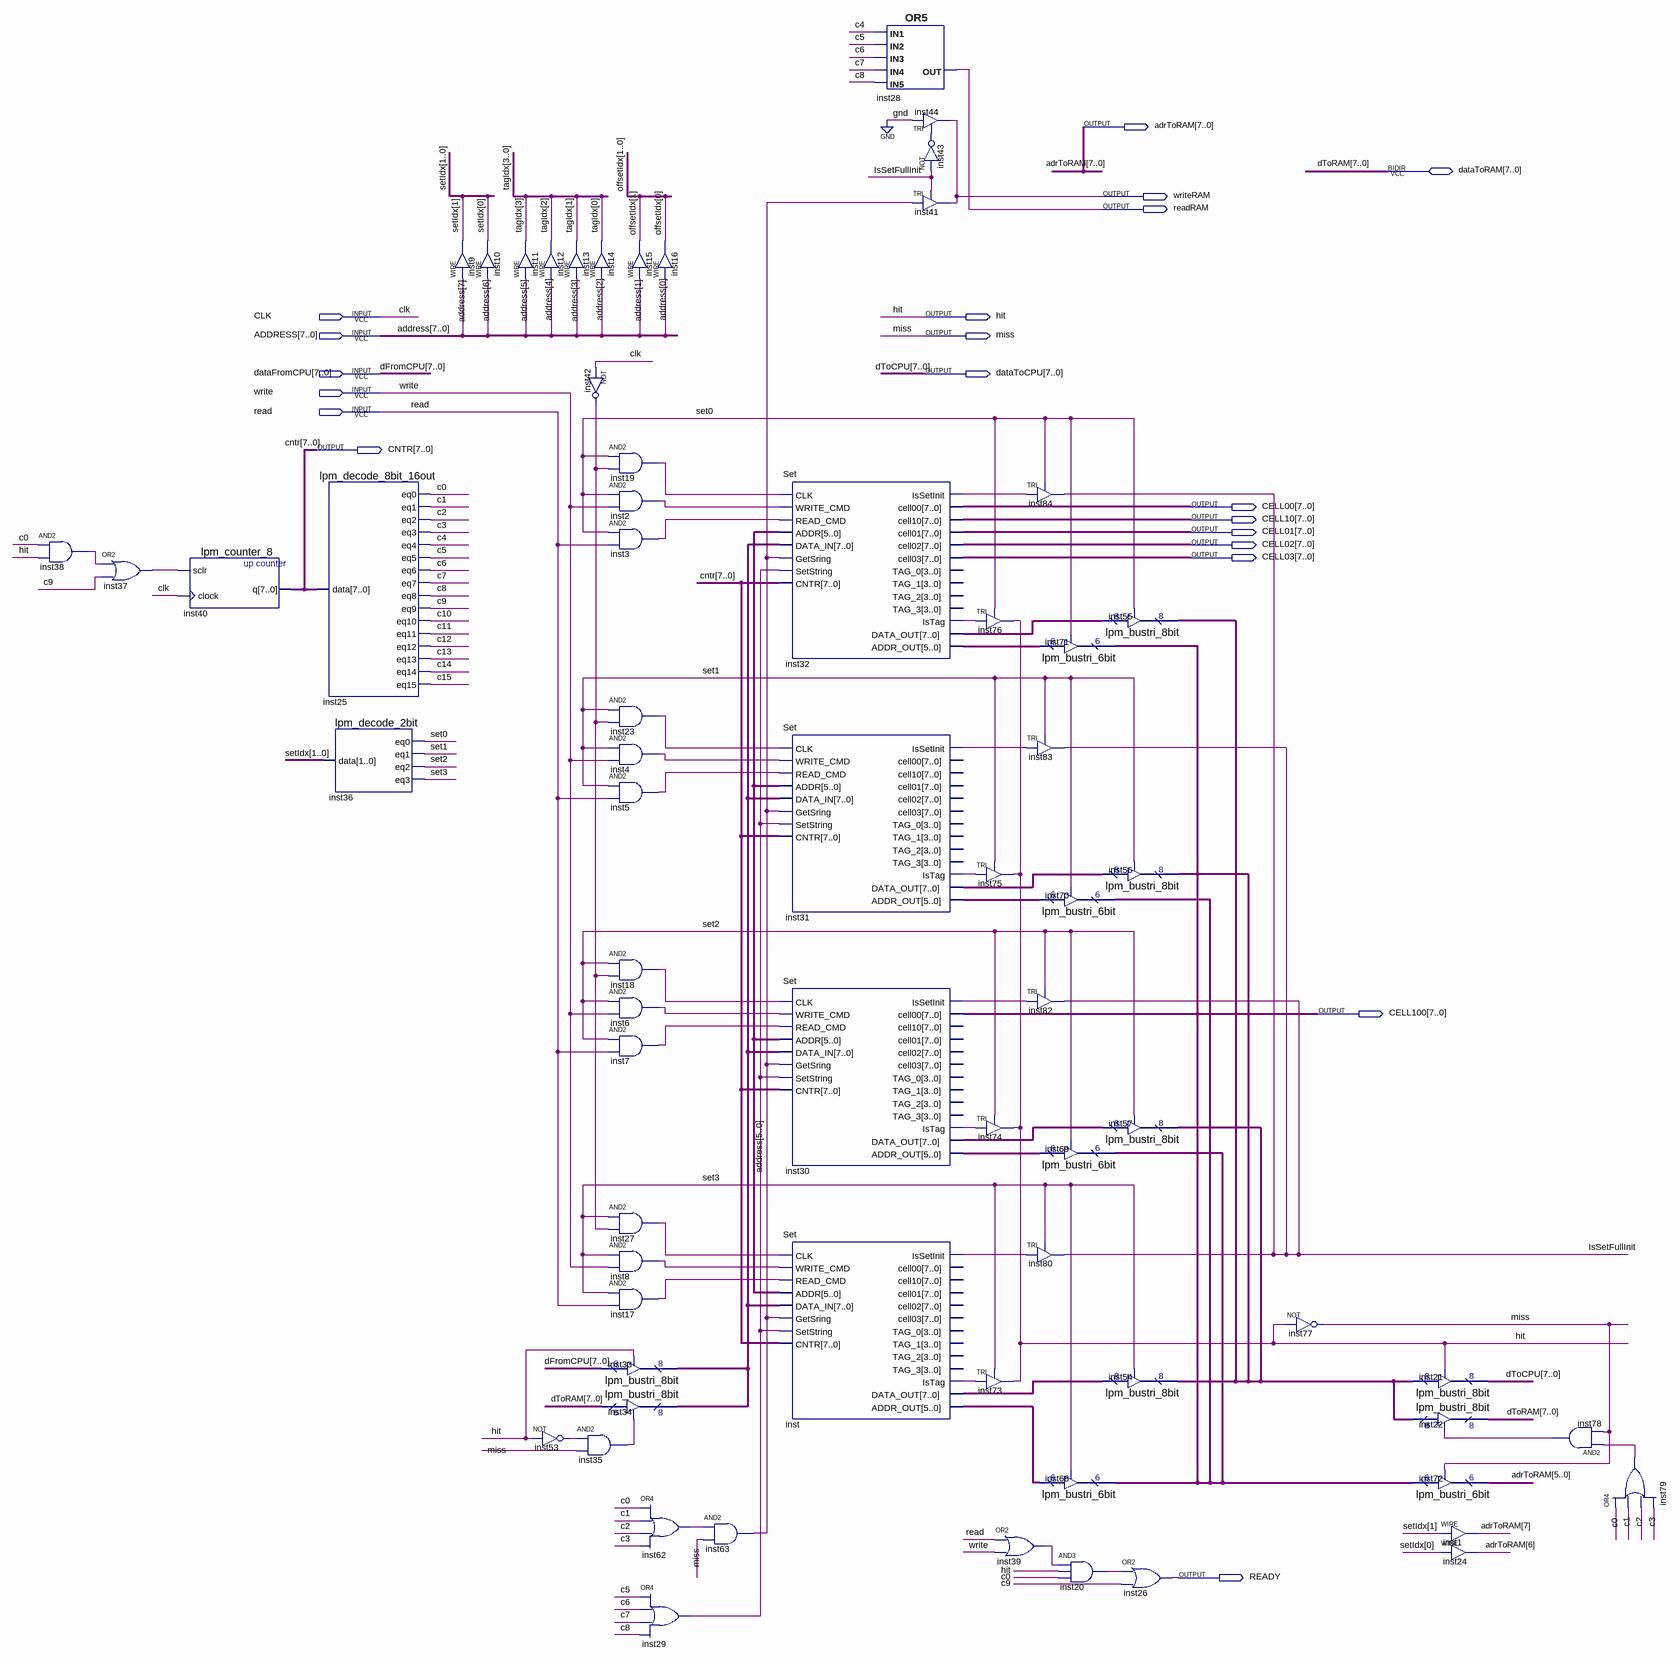
[diagram p0: schematic sheet]
// Quartus schematic Cache.bdf as structural Verilog: 68 symbols, 20 pins
module Cache (
  input  CLK,
  input  [7:0] ADDRESS,
  input  [7:0] dataFromCPU,
  input  write,
  input  read,
  inout  [7:0] dataToRAM,
  output [7:0] adrToRAM,
  output writeRAM,
  output readRAM,
  output hit,
  output miss,
  output [7:0] dataToCPU,
  output [7:0] CNTR,
  output [7:0] CELL00,
  output [7:0] CELL10,
  output [7:0] CELL01,
  output [7:0] CELL02,
  output [7:0] CELL03,
  output [7:0] CELL100,
  output READY
);

  wire c0, c1, c2, c3, c4, c5, c6, c7, c8, c9, c10, c11, c12, c13, c14, c15, inst2_out, inst3_out, inst4_out,
       inst5_out, inst6_out, inst7_out, inst8_out, inst17_out, inst18_out, inst19_out, inst20_out,
       inst23_out, inst27_out, inst29_out, inst30_issetinit, inst30_istag, inst31_issetinit, inst31_istag,
       inst32_issetinit, inst32_istag, inst35_out, inst37_out, inst38_out, inst39_out, inst42_out,
       inst43_out, inst53_out, inst62_out, inst63_out, inst78_out, inst79_out, inst_issetinit, inst_istag,
       IsSetFullInit, set0, set1, set2, set3;
  wire [1:0] offsetIdx, setIdx;
  wire [3:0] tagIdx;
  wire [5:0] inst30_addr_out, inst31_addr_out, inst32_addr_out, inst71_tridata, inst_addr_out;
  wire [7:0] inst30_data_out, inst31_data_out, inst32_data_out, inst33_tridata, inst55_tridata, inst_data_out;

  and inst38 (inst38_out, c0, hit);
  or inst37 (inst37_out, inst38_out, c9);
  lpm_counter_8 inst40 (.sclr(inst37_out), .clock(CLK), .q(CNTR));
  lpm_decode_8bit_16out inst25 (
    .data(CNTR), .eq0(c0), .eq1(c1), .eq2(c2), .eq3(c3), .eq4(c4), .eq5(c5), .eq6(c6), .eq7(c7), .eq8(c8),
    .eq9(c9), .eq10(c10), .eq11(c11), .eq12(c12), .eq13(c13), .eq14(c14), .eq15(c15));
  lpm_decode_2bit inst36 (.data(setIdx), .eq0(set0), .eq1(set1), .eq2(set2), .eq3(set3));
  assign setIdx[1] = ADDRESS[7];  // WIRE inst9
  assign setIdx[0] = ADDRESS[6];  // WIRE inst10
  assign tagIdx[3] = ADDRESS[5];  // WIRE inst11
  assign tagIdx[2] = ADDRESS[4];  // WIRE inst12
  assign tagIdx[1] = ADDRESS[3];  // WIRE inst13
  and inst35 (inst35_out, inst53_out, miss);
  not inst53 (inst53_out, hit);
  assign tagIdx[0] = ADDRESS[2];  // WIRE inst14
  assign offsetIdx[1] = ADDRESS[1];  // WIRE inst15
  not inst42 (inst42_out, CLK);
  and inst19 (inst19_out, set0, inst42_out);
  and inst2 (inst2_out, set0, write);
  and inst3 (inst3_out, set0, read);
  and inst23 (inst23_out, set1, inst42_out);
  and inst4 (inst4_out, set1, write);
  and inst5 (inst5_out, set1, read);
  and inst18 (inst18_out, set2, inst42_out);
  and inst6 (inst6_out, set2, write);
  and inst7 (inst7_out, set2, read);
  and inst27 (inst27_out, set3, inst42_out);
  and inst8 (inst8_out, set3, write);
  and inst17 (inst17_out, set3, read);
  lpm_bustri_8bit inst33 (.enabledt(hit), .data(dataFromCPU), .tridata(inst33_tridata));
  lpm_bustri_8bit inst34 (.enabledt(inst35_out), .data(dataToRAM), .tridata(inst33_tridata));
  assign offsetIdx[0] = ADDRESS[0];  // WIRE inst16
  or inst62 (inst62_out, c0, c1, c2, c3);
  or inst29 (inst29_out, c5, c6, c7, c8);
  and inst63 (inst63_out, inst62_out, miss);
  Set inst32 (
    .CLK(inst19_out), .WRITE_CMD(inst2_out), .READ_CMD(inst3_out), .ADDR(ADDRESS[5:0]),
    .DATA_IN(inst33_tridata), .GetSring(inst63_out), .SetString(inst29_out), .CNTR(CNTR),
    .IsSetInit(inst32_issetinit), .cell00(CELL00), .cell10(CELL10), .cell01(CELL01), .cell02(CELL02),
    .cell03(CELL03), .IsTag(inst32_istag), .DATA_OUT(inst32_data_out), .ADDR_OUT(inst32_addr_out));  // open: TAG_0, TAG_1, TAG_2, TAG_3
  Set inst31 (
    .CLK(inst23_out), .WRITE_CMD(inst4_out), .READ_CMD(inst5_out), .ADDR(ADDRESS[5:0]),
    .DATA_IN(inst33_tridata), .GetSring(inst63_out), .SetString(inst29_out), .CNTR(CNTR),
    .IsSetInit(inst31_issetinit), .IsTag(inst31_istag), .DATA_OUT(inst31_data_out), .ADDR_OUT(inst31_addr_out));  // open: cell00, cell10, cell01, cell02, cell03, TAG_0, TAG_1, TAG_2, TAG_3
  Set inst30 (
    .CLK(inst18_out), .WRITE_CMD(inst6_out), .READ_CMD(inst7_out), .ADDR(ADDRESS[5:0]),
    .DATA_IN(inst33_tridata), .GetSring(inst63_out), .SetString(inst29_out), .CNTR(CNTR),
    .IsSetInit(inst30_issetinit), .cell00(CELL100), .IsTag(inst30_istag), .DATA_OUT(inst30_data_out),
    .ADDR_OUT(inst30_addr_out));  // open: cell10, cell01, cell02, cell03, TAG_0, TAG_1, TAG_2, TAG_3
  Set inst (
    .CLK(inst27_out), .WRITE_CMD(inst8_out), .READ_CMD(inst17_out), .ADDR(ADDRESS[5:0]),
    .DATA_IN(inst33_tridata), .GetSring(inst63_out), .SetString(inst29_out), .CNTR(CNTR),
    .IsSetInit(inst_issetinit), .IsTag(inst_istag), .DATA_OUT(inst_data_out), .ADDR_OUT(inst_addr_out));  // open: cell00, cell10, cell01, cell02, cell03, TAG_0, TAG_1, TAG_2, TAG_3
  or inst28 (readRAM, c4, c5, c6, c7, c8);
  TRI inst44 (.IN(1'b0), .OE(inst43_out), .OUT(writeRAM));
  not inst43 (inst43_out, IsSetFullInit);
  TRI inst41 (.IN(inst63_out), .OE(IsSetFullInit), .OUT(writeRAM));
  TRI inst76 (.IN(inst32_istag), .OE(set0), .OUT(hit));
  TRI inst75 (.IN(inst31_istag), .OE(set1), .OUT(hit));
  TRI inst74 (.IN(inst30_istag), .OE(set2), .OUT(hit));
  TRI inst73 (.IN(inst_istag), .OE(set3), .OUT(hit));
  TRI inst84 (.IN(inst32_issetinit), .OE(set0), .OUT(IsSetFullInit));
  TRI inst83 (.IN(inst31_issetinit), .OE(set1), .OUT(IsSetFullInit));
  TRI inst82 (.IN(inst30_issetinit), .OE(set2), .OUT(IsSetFullInit));
  TRI inst80 (.IN(inst_issetinit), .OE(set3), .OUT(IsSetFullInit));
  or inst39 (inst39_out, read, write);
  lpm_bustri_6bit inst71 (.enabledt(set0), .data(inst32_addr_out), .tridata(inst71_tridata));
  lpm_bustri_6bit inst70 (.enabledt(set1), .data(inst31_addr_out), .tridata(inst71_tridata));
  lpm_bustri_6bit inst69 (.enabledt(set2), .data(inst30_addr_out), .tridata(inst71_tridata));
  lpm_bustri_6bit inst68 (.enabledt(set3), .data(inst_addr_out), .tridata(inst71_tridata));
  and inst20 (inst20_out, inst39_out, hit, c0);
  lpm_bustri_8bit inst55 (.enabledt(set0), .data(inst32_data_out), .tridata(inst55_tridata));
  lpm_bustri_8bit inst56 (.enabledt(set1), .data(inst31_data_out), .tridata(inst55_tridata));
  lpm_bustri_8bit inst57 (.enabledt(set2), .data(inst30_data_out), .tridata(inst55_tridata));
  lpm_bustri_8bit inst54 (.enabledt(set3), .data(inst_data_out), .tridata(inst55_tridata));
  or inst26 (READY, inst20_out, c9);
  not inst77 (miss, hit);
  lpm_bustri_8bit inst21 (.enabledt(hit), .data(inst55_tridata), .tridata(dataToCPU));
  lpm_bustri_8bit inst22 (.enabledt(inst78_out), .data(inst55_tridata), .tridata(dataToRAM));
  lpm_bustri_6bit inst72 (.enabledt(miss), .data(inst71_tridata), .tridata(adrToRAM[5:0]));
  assign adrToRAM[7] = setIdx[1];  // WIRE inst1
  assign adrToRAM[6] = setIdx[0];  // WIRE inst24
  and inst78 (inst78_out, inst79_out, miss);
  or inst79 (inst79_out, c0, c1, c2, c3);

  // Other names for the same wires on the sheet: dFromCPU[7:0] = dataFromCPU; dToCPU[7:0] = dataToCPU;
  //   dToRAM[7:0] = dataToRAM
endmodule
